# EAGLE design ChargerShieldwFront (EAGLE 6.5.0)
Dings

## Sheet 1 of 2: User Interface
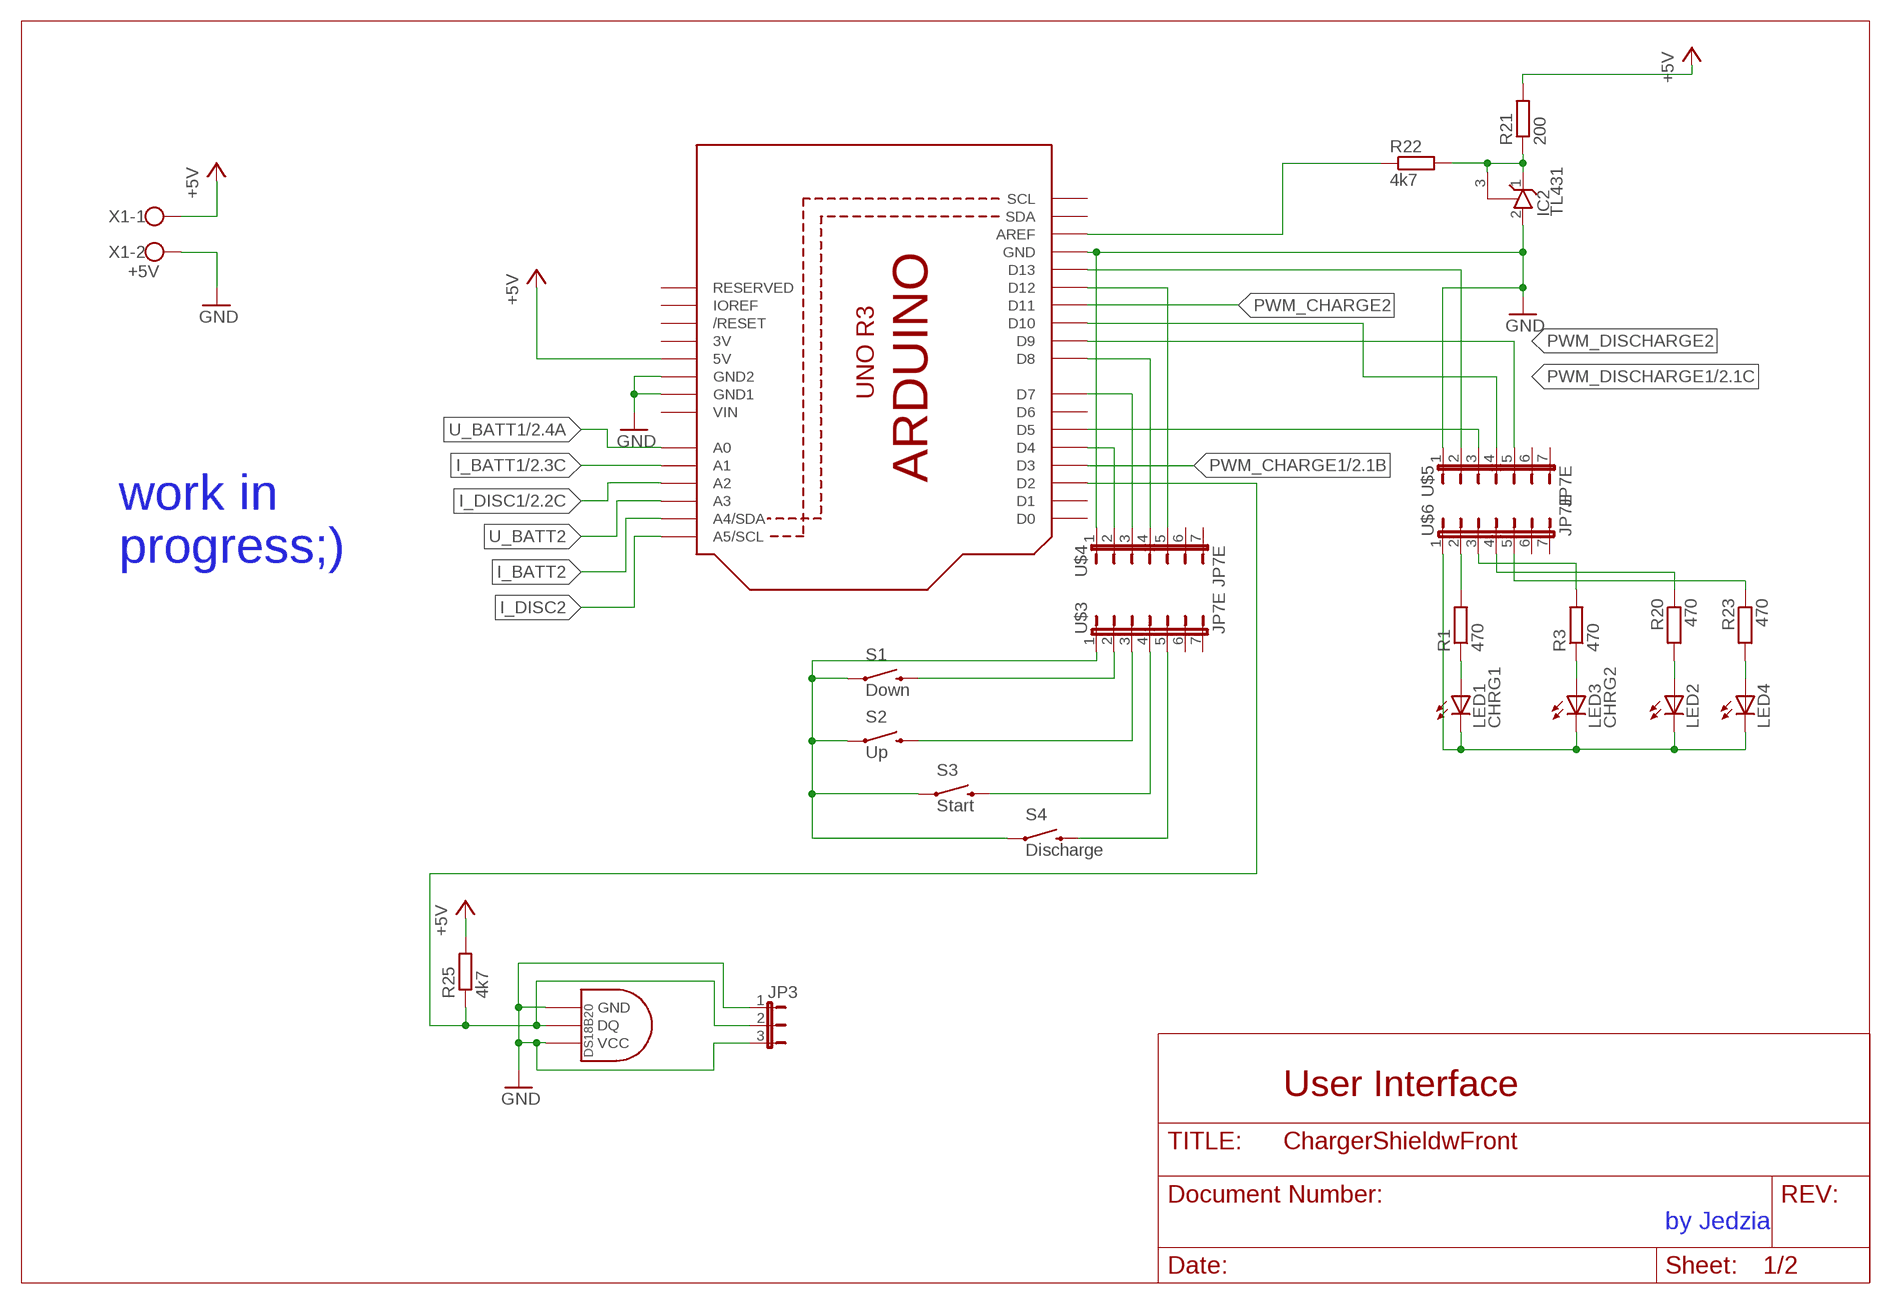
[diagram p0: schematic, sheet 1]

### Parts
IC2  TL431  TL431TO92  [TO92]
JP3  JP2E  [JP2]
LED1  CHRG1  LED5MM_BIG  [LED5MM_BIG]
LED2  LED5MM_BIG  [LED5MM_BIG]
LED3  CHRG2  LED5MM_BIG  [LED5MM_BIG]
LED4  LED5MM_BIG  [LED5MM_BIG]
R1  470  R-EU_0207/12  [0207/12]
R3  470  R-EU_0207/10  [0207/10]
R20  470  R-EU_0207/10  [0207/10]
R21  200  R-EU_0204/7  [0204/7]
R22  4k7  R-EU_0207/10  [0207/10]
R23  470  R-EU_0207/10  [0207/10]
R25  4k7  R-EU_0204/7  [0204/7]
S1  Down  SWITCH-MOMENTARY-2PTH  [TACTILE-PTH]
S2  Up  SWITCH-MOMENTARY-2PTH  [TACTILE-PTH]
S3  Start  SWITCH-MOMENTARY-2PTH  [TACTILE-PTH]
S4  Discharge  SWITCH-MOMENTARY-2PTH  [TACTILE-PTH]
U$1  ARDUINOR3BPLACE-LONG  [ARDUINOR3-BPLACE-LONG]
U$2  DS1820TO92  [DS1820]
U$3  JP7E  [JP7]
U$4  JP7E  [JP7]
U$5  JP7E  [JP7]
U$6  JP7E  [JP7]
X1  +5V  W237-102  [W237-102]

### Nets
+5V: R21.2 R25.2 U$1.5V X1.1 ; also sheet 2
GND: IC2.2(A) JP3.1 JP3.3 U$1.GND U$1.GND1 U$1.GND2 U$2.GND U$2.VDD(VCC) U$4.1 U$5.1 X1.2 ; also sheet 2
GND2: LED1.K(C) LED2.K(C) LED3.K(C) LED4.K(C) S1.1 S2.1 S3.1 S4.1 U$3.1 U$6.1
I_BATT1: U$1.A1 ; also sheet 2
I_BATT2: U$1.A4(A4/SDA)
I_DISC1: U$1.A2 ; also sheet 2
I_DISC2: U$1.A5(A5/SCL)
N$1: U$1.D13 U$5.2
N$2: LED1.A R1.1
N$3: S1.3 U$3.2
N$4: S2.3 U$3.3
N$12: JP3.2 R25.1 U$1.D2 U$2.DQ
N$19: U$1.D5 U$5.3
N$20: LED2.A R20.2
N$21: LED4.A R23.2
N$22: S3.3 U$3.4
N$23: U$1.D12 U$4.5
N$24: LED3.A R3.1
N$26: U$1.D4 U$4.2
N$27: IC2.1(C) IC2.3(R) R21.1 R22.2
N$28: R22.1 U$1.AREF
N$30: U$1.D7 U$4.3
N$31: U$1.D8 U$4.4
N$32: S4.3 U$3.5
N$33: R3.2 U$6.3
N$34: R1.2 U$6.2
N$35: R20.1 U$6.4
N$36: R23.1 U$6.5
PWM_CHARGE1: U$1.D3 ; also sheet 2
PWM_CHARGE2: U$1.D11
PWM_DISCHARGE1: U$1.D10 U$5.4 ; also sheet 2
PWM_DISCHARGE2: U$1.D9 U$5.5
U_BATT1: U$1.A0 ; also sheet 2
U_BATT2: U$1.A3
Unconnected: U$1.D0 U$1.D1 U$1.D6 U$1.IOREF U$1.RESERVED U$1.RESET(/RESET) U$1.SCL U$1.SDA U$3.6 U$3.7 U$4.6 U$4.7 U$5.6 U$5.7 U$6.6 U$6.7

### Notes on the sheet
- work in
  progress;)
- User Interface
- by Jedzia

## Sheet 2 of 2
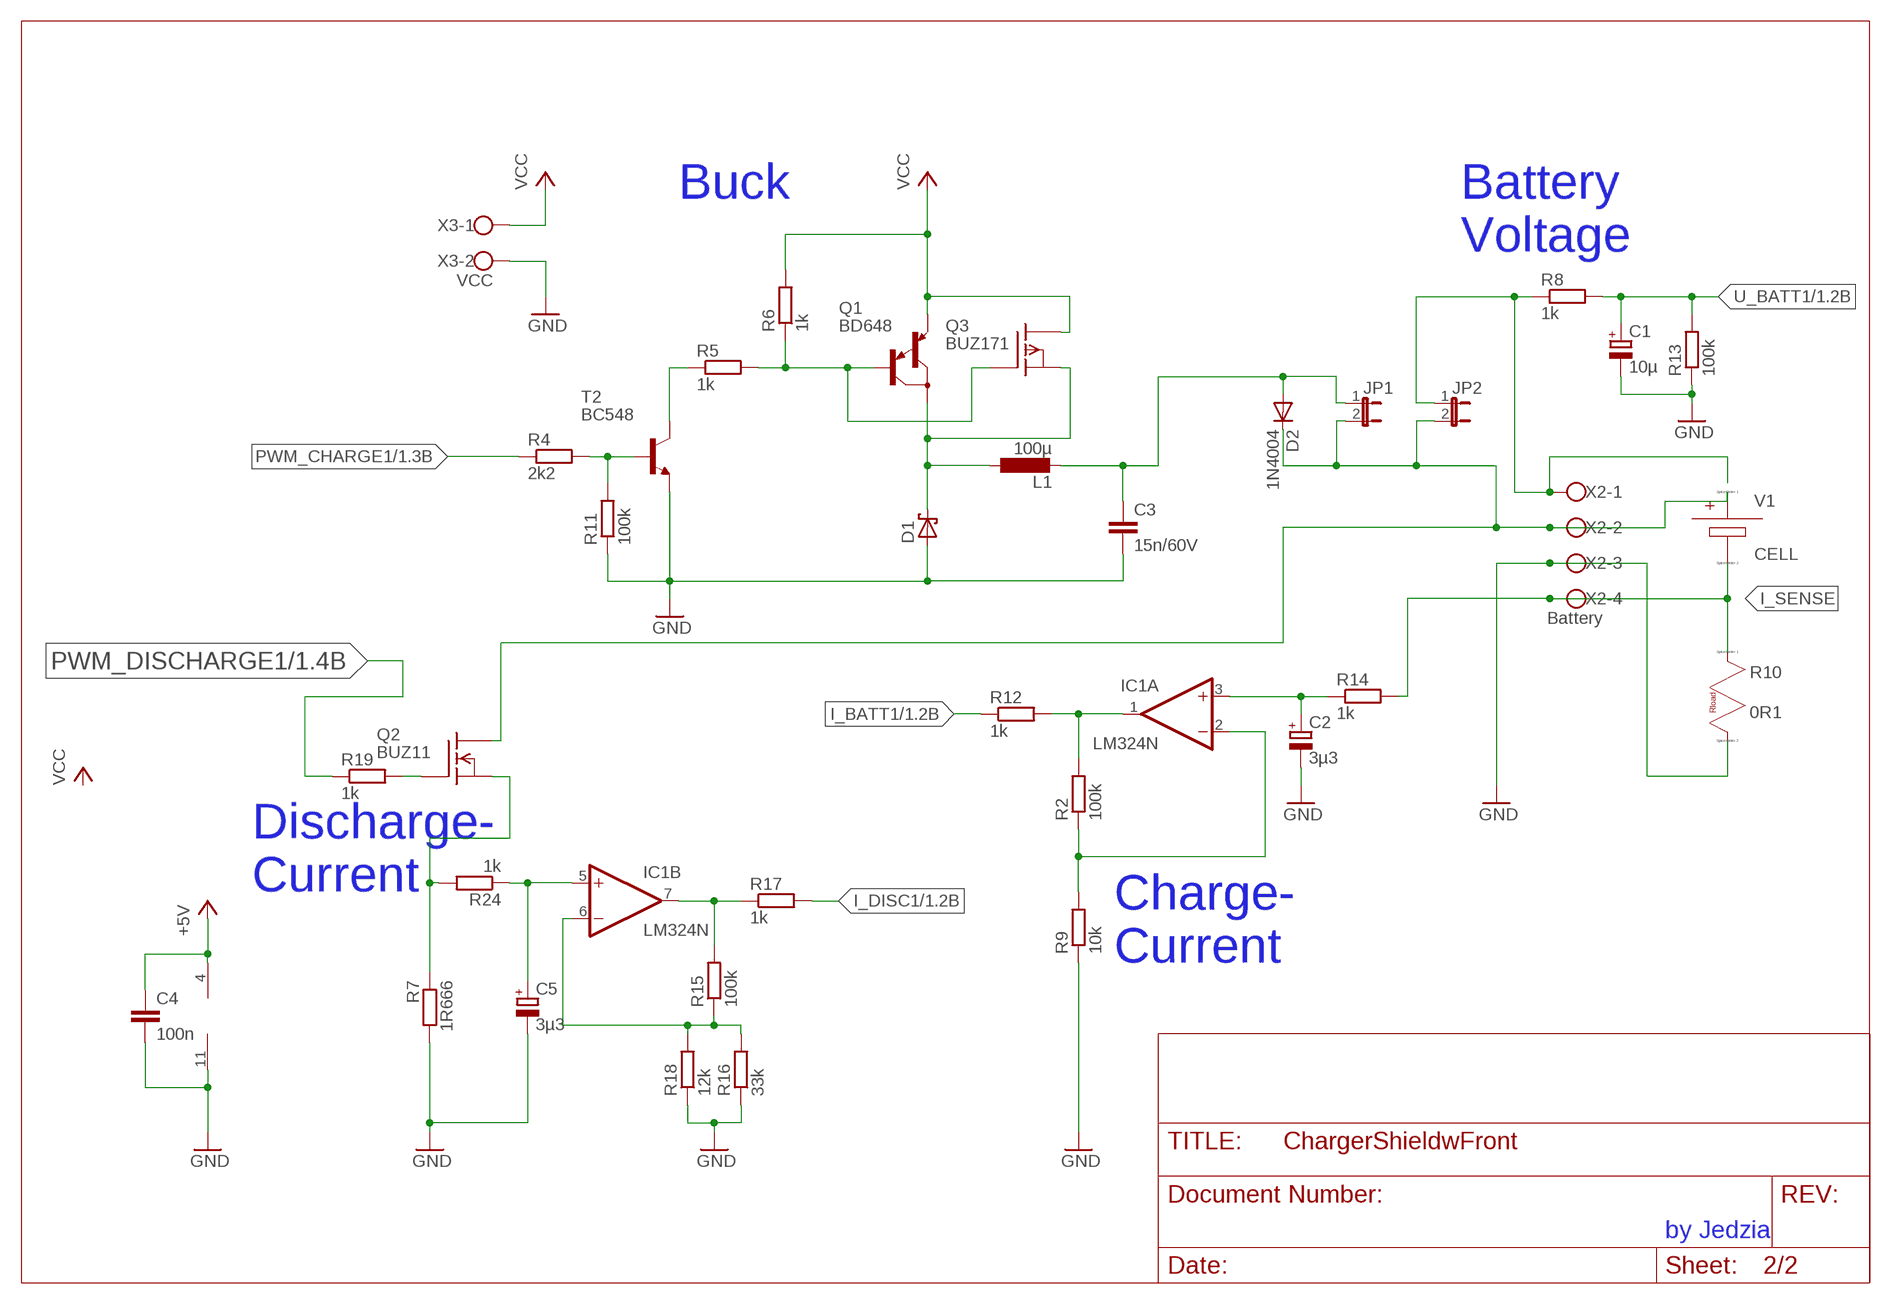
[diagram p1: schematic, sheet 2]

### Parts
C1  10µ  CPOL-EUE5-5  [E5-5]
C2  3µ3  CPOL-EUE5-5  [E5-5]
C3  15n/60V  C-EU025_050-025X075  [C025_050-025X075]
C4  100n  C-EU025_050-025X075  [C025_050-025X075]
C5  3µ3  CPOL-EUE5-5  [E5-5]
D1  SCHOTTKY-DIODEDO35-7  [DO35-7]
D2  1N4004  [DO41-10]
IC1  LM324N  [DIL14]
JP1  JP1E  [JP1]
JP2  JP1E  [JP1]
L1  100µ  L-EU0207/12  [0207/12]
Q1  BD648  [TO220]
Q2  BUZ11  [TO220]
Q3  BUZ171  [TO220]
R2  100k  R-EU_0204/7  [0204/7]
R4  2k2  R-EU_0207/10  [0207/10]
R5  1k  R-EU_0207/10  [0207/10]
R6  1k  R-EU_0207/10  [0207/10]
R7  1R666  R-EU_0414/15  [0414/15]
R8  1k  R-EU_0207/10  [0207/10]
R9  10k  R-EU_0204/7  [0204/7]
R10  0R1  RES_RLOAD  (no package)
R11  100k  R-EU_0207/10  [0207/10]
R12  1k  R-EU_0207/12  [0207/12]
R13  100k  R-EU_0207/10  [0207/10]
R14  1k  R-EU_0207/10  [0207/10]
R15  100k  R-EU_0207/10  [0207/10]
R16  33k  R-EU_0207/10  [0207/10]
R17  1k  R-EU_0207/15  [0207/15]
R18  12k  R-EU_0207/10  [0207/10]
R19  1k  R-EU_0207/12  [0207/12]
R24  1k  R-EU_0207/10  [0207/10]
T2  BC548  BC238  [TO92]
V1  CELL  (no package)
X2  Battery  W237-4  [W237-4]
X3  VCC  W237-102  [W237-102]

### Nets
+5V: C4.1 IC1.4(P:V+) ; also sheet 1
GND: C1.- C2.- C3.2 C4.2 C5.- D1.A IC1.11(P:V-) R7.2 R9.1 R10.B R11.1 R13.1 R16.1 R18.1 T2.1(E) X2.3 X3.2 ; also sheet 1
I_BATT1: R12.1 ; also sheet 1
I_DISC1: R17.2 ; also sheet 1
I_SENSE: R10.A R14.2 V1.- X2.4
N$5: R4.2 R11.2 T2.2(B)
N$6: R5.1 T2.3(C)
N$7: Q1.1(B) Q3.1(G) R5.2 R6.1
N$8: JP2.1 R8.1 X2.1
N$9: D1.C L1.1 Q1.2(C) Q3.3(S)
N$10: C3.1 D2.A JP1.1 L1.2
N$11: IC1.1(A:OUT) R2.2 R12.2
N$13: D2.C JP1.2 JP2.2 Q2.2(D) V1.+ X2.2
N$14: IC1.2(A:-IN) R2.1 R9.2
N$15: C2.+ IC1.3(A:+IN) R14.1
N$16: IC1.6(B:-IN) R15.1 R16.2 R18.2
N$17: IC1.7(B:OUT) R15.2 R17.1
N$18: Q2.1(G) R19.2
N$25: Q2.3(S) R7.1 R24.2
N$29: C5.+ IC1.5(B:+IN) R24.1
PWM_CHARGE1: R4.1 ; also sheet 1
PWM_DISCHARGE1: R19.1 ; also sheet 1
U_BATT1: C1.+ R8.2 R13.2 ; also sheet 1
VCC: Q1.3(E) Q3.2(D) R6.2 X3.1
Unconnected: IC1.8(C:OUT) IC1.9(C:-IN) IC1.10(C:+IN) IC1.12(D:+IN) IC1.13(D:-IN) IC1.14(D:OUT)

### Notes on the sheet
- Buck
- Battery
  Voltage
- Discharge-
  Current
- Charge-
  Current
- by Jedzia

## Power pins joined to a net without a drawn wire
3V: U$1.3V
VIN: U$1.VIN

## Library data of the parts
C1 C2 C5 = rcl:CPOL-EU: POLARIZED CAPACITOR, European symbol
C3 C4 = rcl:C-EU: CAPACITOR, European symbol
D1 = diode:SCHOTTKY-DIODE: Schottky Diode
D2 = diode:1N4004: DIODE general purpose rectifier, 1 A
IC1 = linear:LM324: OP AMP
IC2 = AWJLEagleLib:TL431: TL431 shunt regulator CARE: not a standard pinout. This part has 1: cathode, 2: REF, 3: anode
JP1 JP2 = bigger:JP1E: JUMPER
JP3 = bigger:JP2E: JUMPER
L1 = rcl:L-EU: INDUCTOR, European symbol
LED1-LED4 = bigger:LED: LED OSRAM: - CHIPLED LG R971, LG N971, LY N971, LG Q971, LY Q971, LO R971, LY R971 LH N974, LH R974 LS Q976, LO Q976, LY Q976 LO Q996 - Hyper CHIPLED LW Q18S LB Q993, LB Q99A, LB R99A - SideLED LS A670, LO A670, LY A670, LG A670, LP A670 LB A673, LV A673, LT A673, LW A673 LH A674 LY A675 LS A676, LA A676, LO A676, LY A676, LW A676 LS A679, LY A679, LG A679 - Hyper Micro SIDELED® LS Y876, LA Y876, LO Y876, LY Y876 LT Y87S - SmartLED LW L88C, LW L88S LB L89C, LB L89S, LG L890 LS L89K, LO L89K, LY L89K LS L896, LA L896, LO L896, LY L896 - TOPLED LS T670, LO T670, LY T670, LG T670, LP T670 LSG T670, LSP T670, LSY T670, LOP T670, LYG T670 LG T671, LOG T671, LSG T671 LB T673, LV T673, LT T673, LW T673 LH T674 LS T676, LA T676, LO T676, LY T676, LB T676, LH T676, LSB T676, LW T676 LB T67C, LV T67C, LT T67C, LS T67K, LO T67K, LY T67K, LW E67C LS E67B, LA E67B, LO E67B, LY E67B, LB E67C, LV E67C, LT E67C LW T67C LS T679, LY T679, LG T679 LS T770, LO T770, LY T770, LG T770, LP T770 LB T773, LV T773, LT T773, LW T773 LH T774 LS E675, LA E675, LY E675, LS T675 LS T776, LA T776, LO T776, LY T776, LB T776 LHGB T686 LT T68C, LB T68C - Hyper Mini TOPLED® LB M676 - Mini TOPLED Santana® LG M470 LS M47K, LO M47K, LY M47K Source: http://www.osram.convergy.de LUXEON: - LUMILED® LXK2-PW12-R00, LXK2-PW12-S00, LXK2-PW14-U00, LXK2-PW14-V00 LXK2-PM12-R00, LXK2-PM12-S00, LXK2-PM14-U00 LXK2-PE12-Q00, LXK2-PE12-R00, LXK2-PE12-S00, LXK2-PE14-T00, LXK2-PE14-U00 LXK2-PB12-K00, LXK2-PB12-L00, LXK2-PB12-M00, LXK2-PB14-N00, LXK2-PB14-P00, LXK2-PB14-Q00 LXK2-PR12-L00, LXK2-PR12-M00, LXK2-PR14-Q00, LXK2-PR14-R00 LXK2-PD12-Q00, LXK2-PD12-R00, LXK2-PD12-S00 LXK2-PH12-R00, LXK2-PH12-S00 LXK2-PL12-P00, LXK2-PL12-Q00, LXK2-PL12-R00 Source: www.luxeon.com KINGBRIGHT: KA-3528ASYC Source: www.kingbright.com
Q1 = transistor-pnp:BD648: PNP Darlington Transistor
Q2 = transistor-fet:BUZ11: N-Channel Enhancement MOSFET 50V; 30A; 0,040Ohm
Q3 = transistor-fet:BUZ171: P-Channel Enhancement MOSFET -50V; 7A; 0,4Ohm
R1-R9 R11-R25 = rcl:R-EU_: RESISTOR, European symbol
R10 = lt-spice-simulation:RES_RLOAD: A resistor
S1-S4 = SparkFun-Electromechanical:SWITCH-MOMENTARY-2: Various NO switches- pushbuttons, reed, etc
T2 = transistor:BC238: NPN TRANSISTOR
U$1 = arduino-long:ARDUINOR3: This is a new object for the new Arduino R3 - with extra pins that you may want to use (such as IOref, and duplicated A4/A5
U$2 = Ava:DS1820: DS18B20 Programmable Resolution 1-Wire Digital Thermometer Description The DS18B20 digital thermometer provides 9-bit to 12-bit Celsius temperature measurements and has an alarm function with nonvolatile user-programmable upper and lower trigger points. The DS18B20 communicates over a 1-Wire® bus that by definition requires only one data line (and ground) for communication with a central microprocessor. It has an operating temperature range of -55°C to +125°C and is accurate to ±0.5°C over the range of -10°C to +85°C. In addition, the DS18B20 can derive power directly from the data line ("parasite power"), eliminating the need for an external power supply. Each DS18B20 has a unique 64-bit serial code, which allows multiple DS18B20s to function on the same 1-Wire bus. Thus, it is simple to use one microprocessor to control many DS18B20s distributed over a large area. Applications that can benefit from this feature include HVAC environmental controls, temperature monitoring systems inside buildings, equipment, or machinery, and process monitoring and control systems.
U$3-U$6 = bigger:JP7E
V1 = Misc:CELL: Voltage Source, either DC, AC, PULSE, SINE, PWL, EXP, or SFFM
X1 X3 = con-wago-500:W237-102: WAGO SCREW CLAMP; MPN: 237-102; OC_FARNELL: unknown; OC_NEWARK: 70K9898
X2 = con-wago-500:W237-4: WAGO SCREW CLAMP; OC_FARNELL: unknown; OC_NEWARK: unknown

## Board
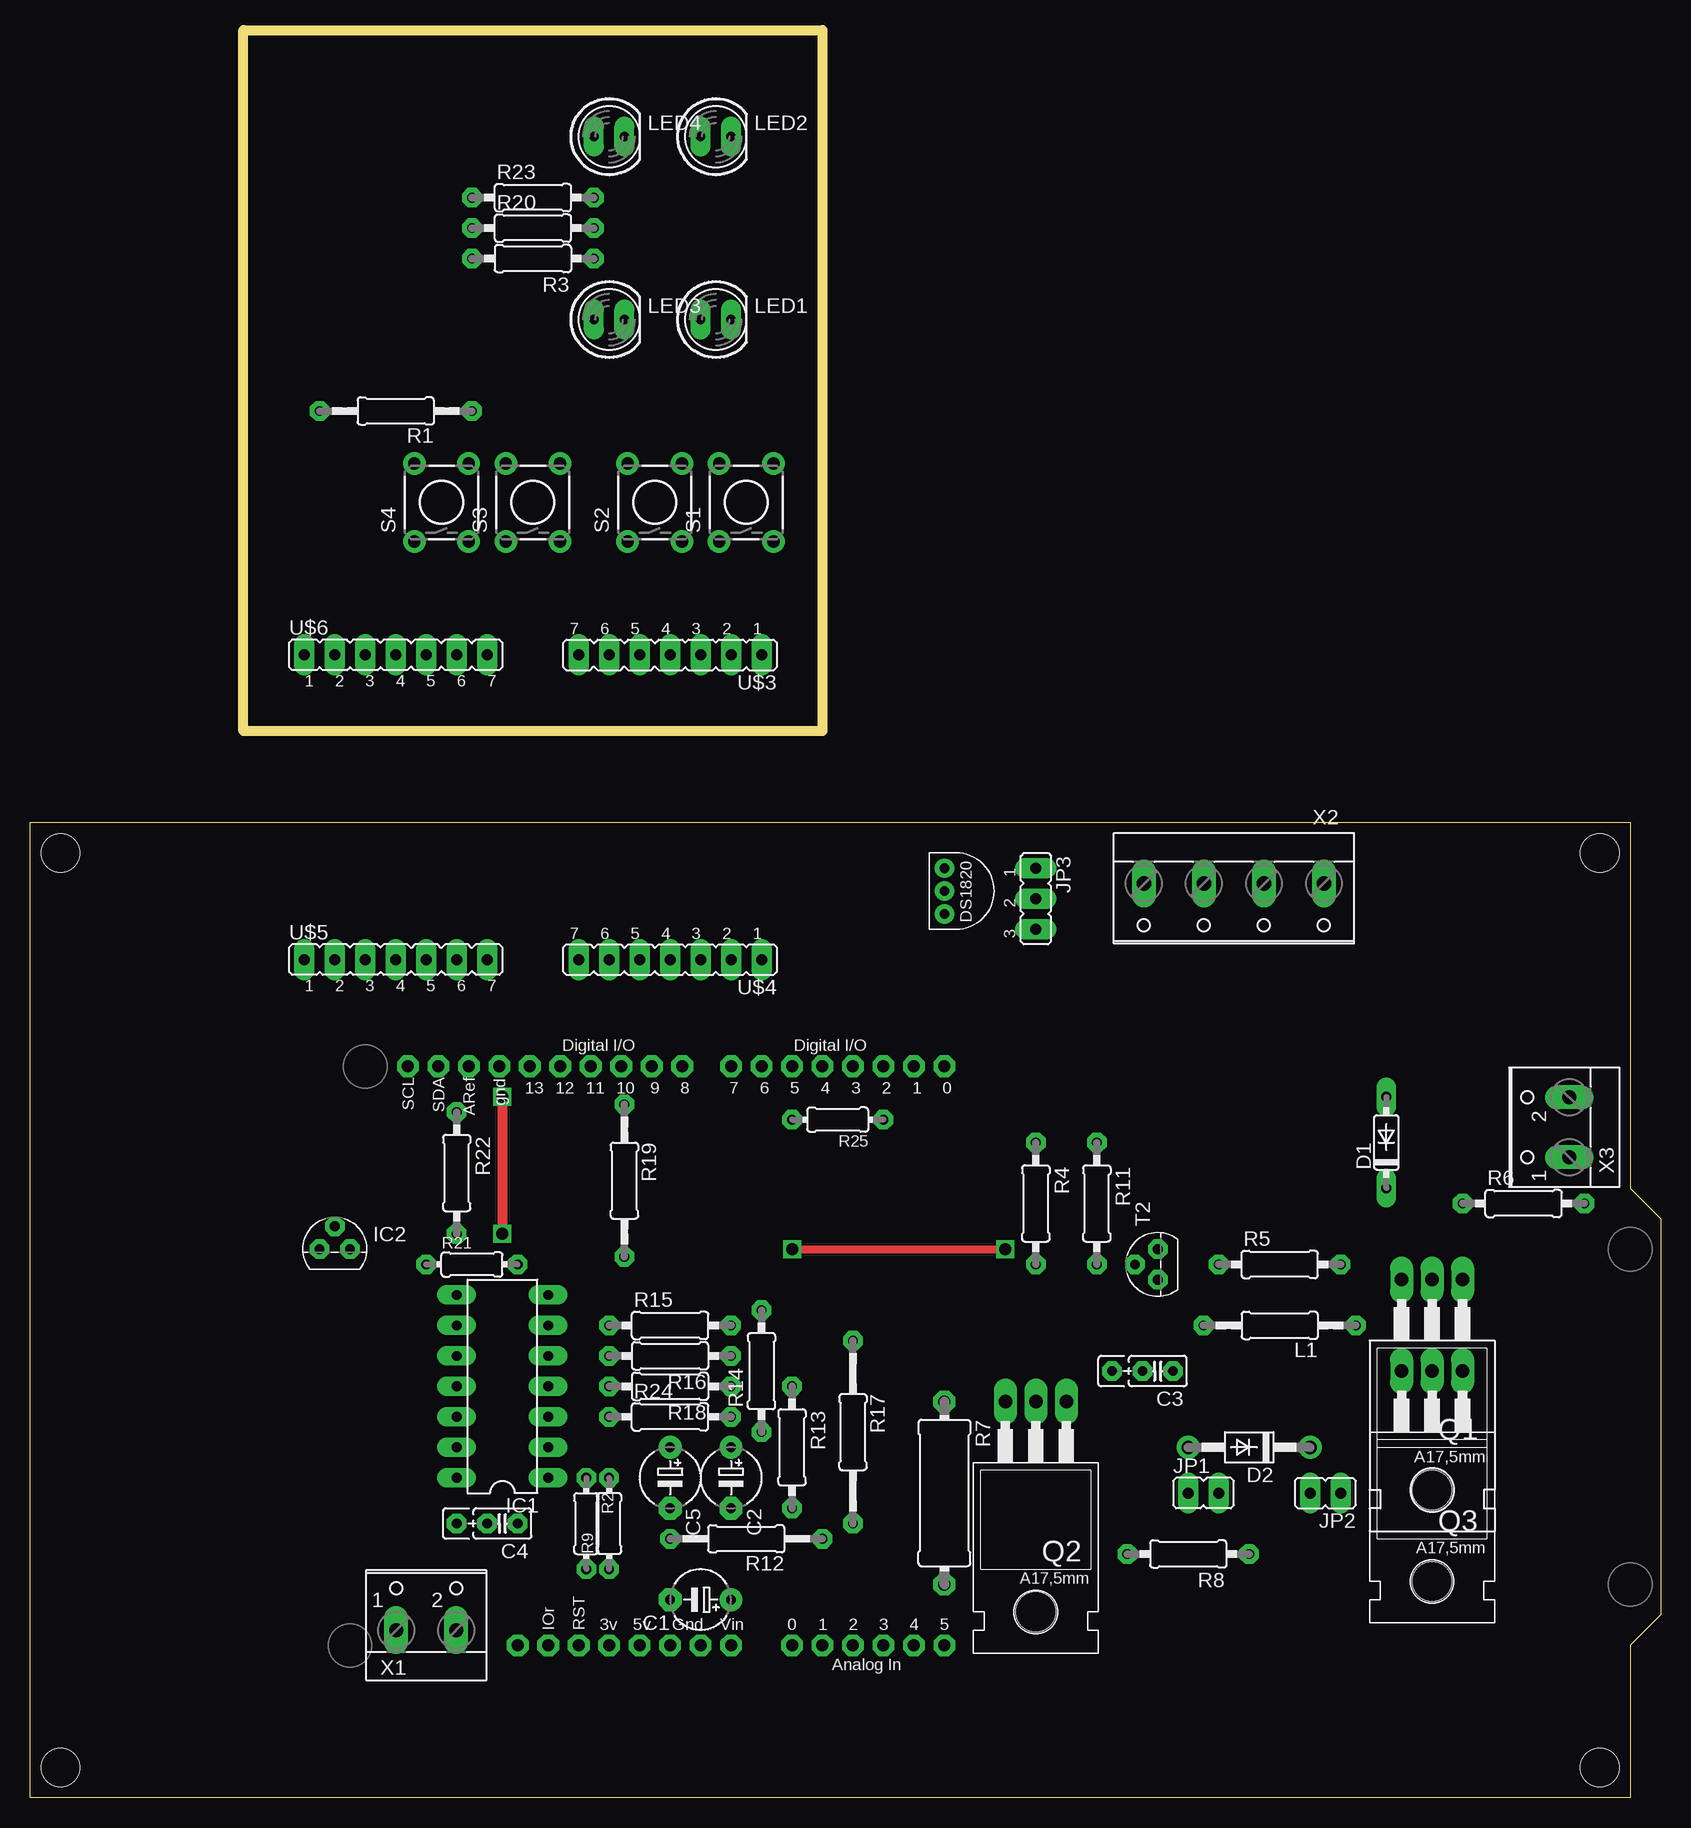
[diagram p2: board, top side]
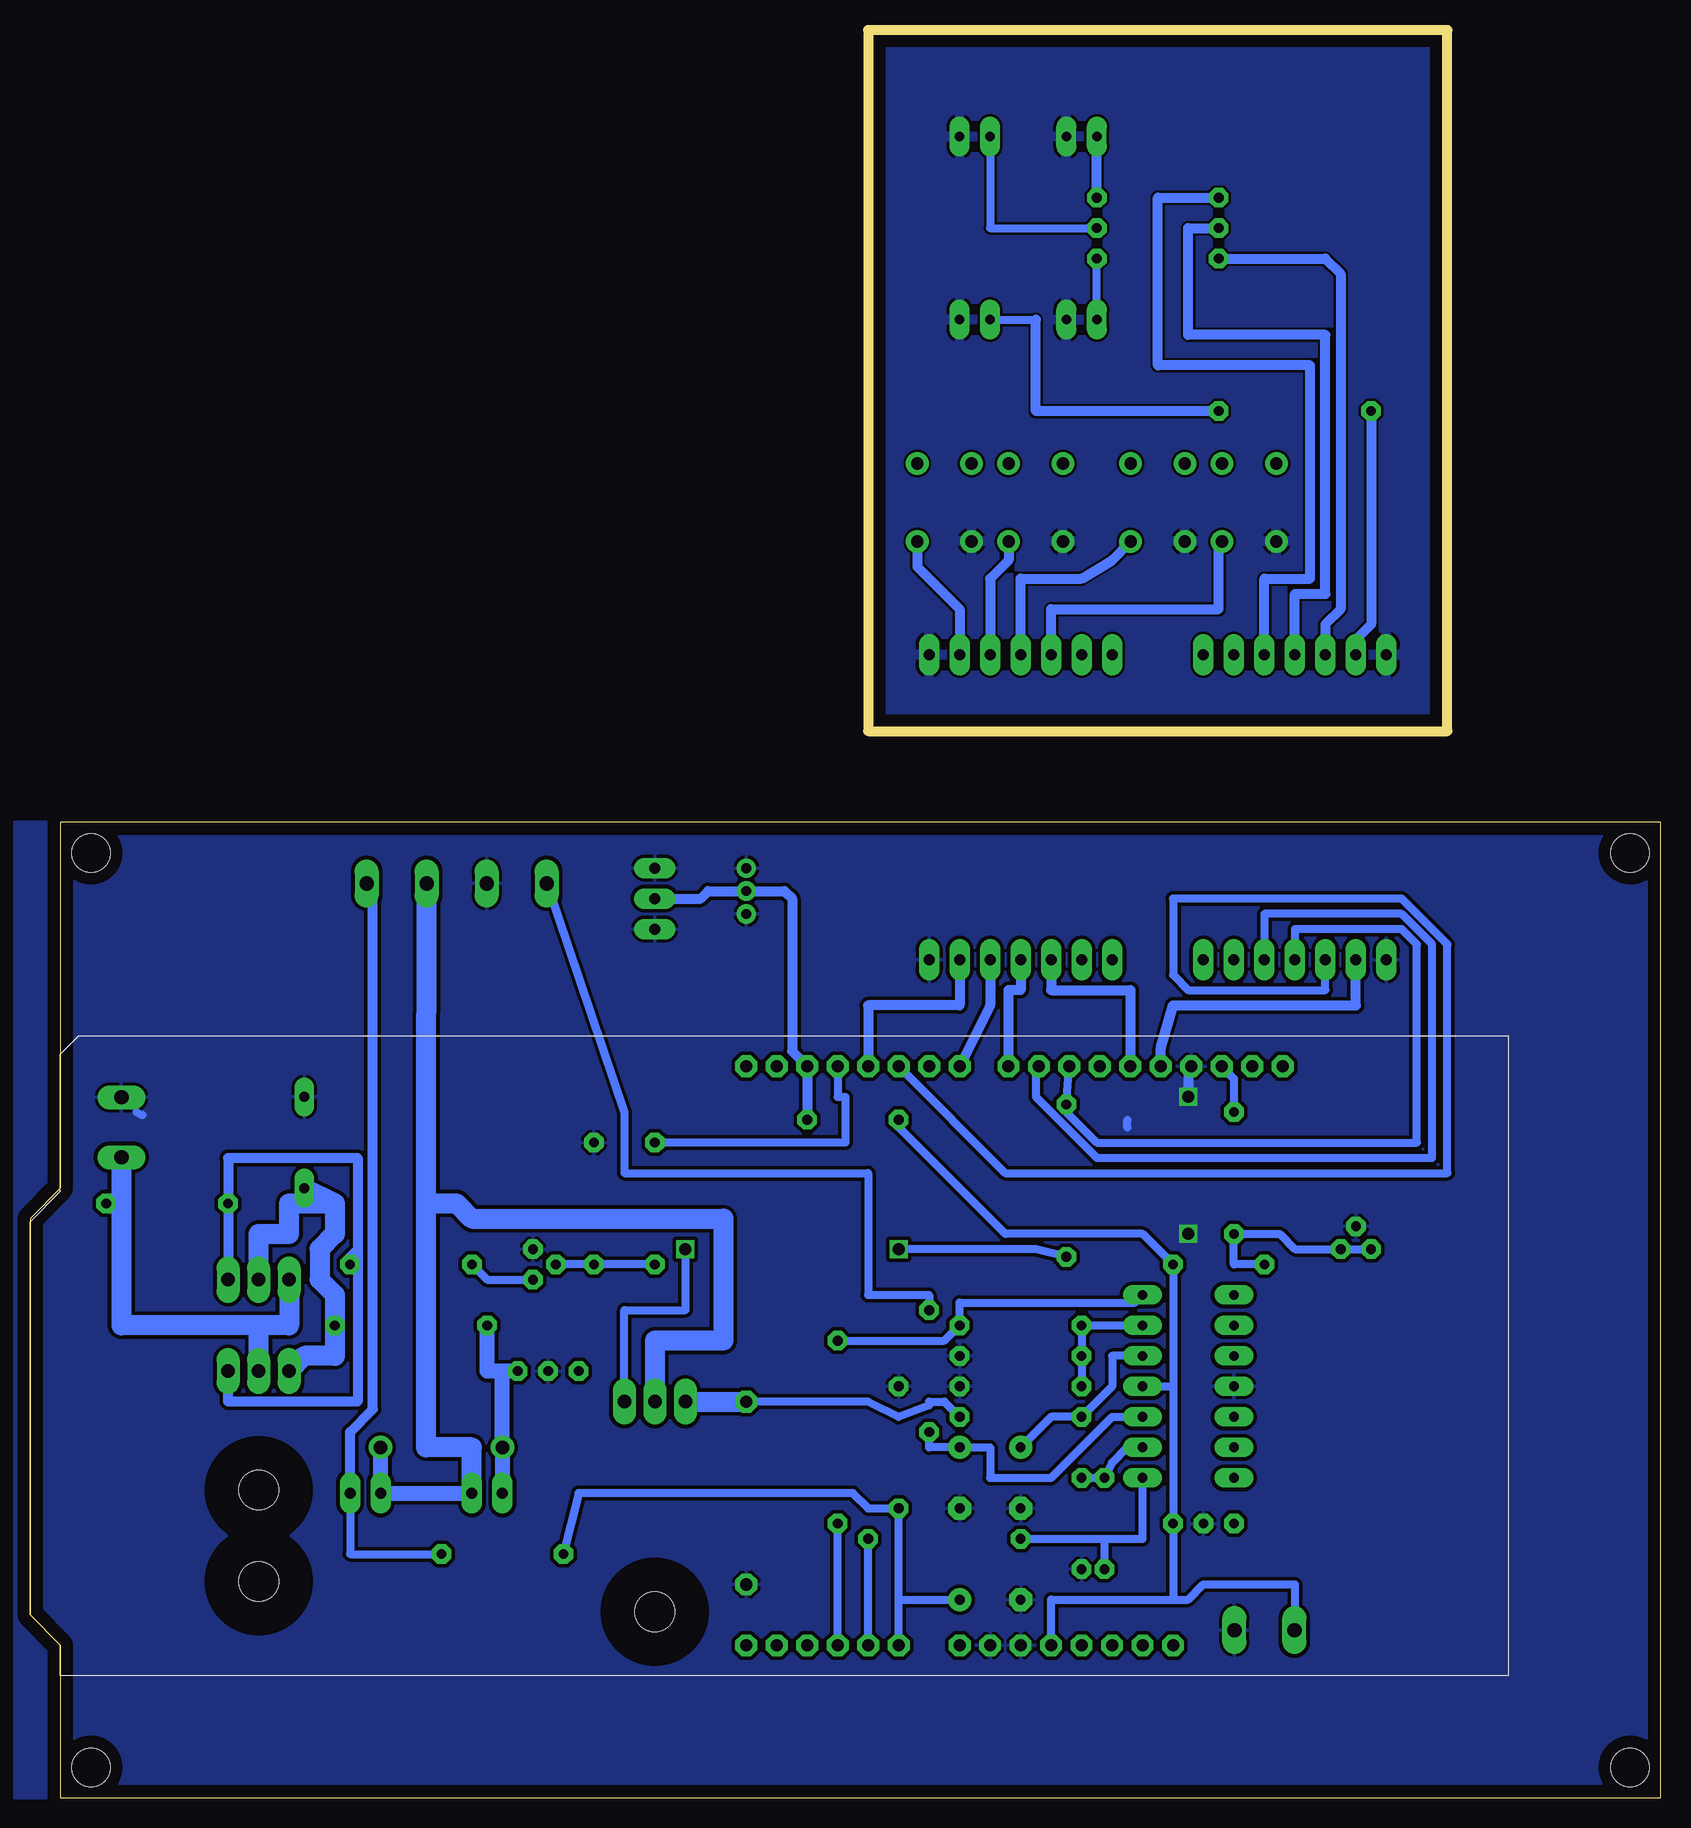
[diagram p3: board, bottom side, seen from below]

Size 135.89 x 147.32 mm. Coordinates in mm from the lower left corner, seen from the top.
Outline: 0,81.28 133.35,81.28 133.35,50.8 135.89,48.26 135.89,15.24 133.35,12.7 133.35,0 0,0 0,81.28
Outline: 66.04,88.9 17.78,88.9 17.78,147.32 66.04,147.32 66.04,88.9
Copper layers (1*16): Top 0.035mm / dielectric 1.5mm / Bottom 0.035mm
Design rules "serialTTl *": minimum track width 26mil, minimum drill 24mil, track to track 8mil, track to pad 8mil, pad to pad 8mil, via to via 8mil, smd to smd 8mil, copper to edge 40mil, drill to drill 8mil, minimum pad ring 16mil, minimum via ring 8mil, stop-mask expansion 4mil, vias tented up to drill 0mil, thermal gap 10mil
Holes 3.2 mm at 2.54,2.54 2.54,78.74 130.81,2.54 130.81,78.74

### Footprints (pad centres in the part's own frame; a part is rotated, then mirrored left to right if it is on the bottom)
E5-5 = drill 0.813 pad 1.905: + -2.54,0 | drill 0.813 pad 1.905 octagon: - 2.54,0
C025_050-025X075 = drill 0.813 octagon: 1 -1.27,0; 2 1.27,0; 3 3.81,0
DO35-7 = drill 0.813 long: A 3.81,0; C -3.81,0
DO41-10 = drill 1.118: A 5.08,0; C -5.08,0
DIL14 = drill 0.813 long: 1 -7.62,-3.81; 2 -5.08,-3.81; 3 -2.54,-3.81; 4 0,-3.81; 5 2.54,-3.81; 6 5.08,-3.81; 7 7.62,-3.81; 8 7.62,3.81; 9 5.08,3.81; 10 2.54,3.81; 11 0,3.81; 12 -2.54,3.81; 13 -5.08,3.81; 14 -7.62,3.81
TO92 = drill 0.813 octagon: 1 1.27,-1.27; 2 0,0.635; 3 -1.27,-1.27
JP1 = drill 0.914 long: 1 0,-1.27; 2 0,1.27
JP2 = drill 0.914 long: 1 -2.54,0; 2 0,0; 3 2.54,0
0207/12 = drill 0.813 octagon: 1 -6.35,0; 2 6.35,0
LED5MM_BIG = drill 0.8 pad 1.676 long: A -1.27,0; K 1.27,0
TO220 = drill 1.118 long: 1 -2.54,-6.35; 2 0,-6.35; 3 2.54,-6.35 | hole 3.302: 0,11.176
0204/7 = drill 0.813 octagon: 1 -3.81,0; 2 3.81,0
0207/10 = drill 0.813 octagon: 1 -5.08,0; 2 5.08,0
0414/15 = drill 1.016 octagon: 1 -7.62,0; 2 7.62,0
0207/15 = drill 0.813 octagon: 1 -7.62,0; 2 7.62,0
TACTILE-PTH = drill 1.016 pad 1.88: 1 -3.251,2.261; 2 3.251,2.261; 3 -3.251,-2.261; 4 3.251,-2.261
TO92' = drill 0.813 octagon: 1 1.27,0; 2 0,1.905; 3 -1.27,0
ARDUINOR3-BPLACE-LONG = drill 1 pad 1.676 octagon: 3V 35.56,2.54; 5V 38.1,2.54; A0 50.8,2.54; A1 53.34,2.54; A2 55.88,2.54; A3 58.42,2.54; A4 60.96,2.54; A5 63.5,2.54; AREF 23.876,50.8; D0 63.5,50.8; D1 60.96,50.8; D2 58.42,50.8; D3 55.88,50.8; D4 53.34,50.8; D5 50.8,50.8; D6 48.26,50.8; D7 45.72,50.8; D8 41.656,50.8; D9 39.116,50.8; D10 36.576,50.8; D11 34.036,50.8; D12 31.496,50.8; D13 28.956,50.8; GND 26.416,50.8; GND1 43.18,2.54; GND2 40.64,2.54; IOREF 30.48,2.54; RESERVED 27.94,2.54; RESET 33.02,2.54; SCL 18.796,50.8; SDA 21.336,50.8; VIN 45.72,2.54
DS1820 = drill 0.8: DQ 2.54,-1.27; GND 0.635,-1.27; VDD 4.445,-1.27
JP7 = drill 0.914 long: 1 -7.62,0; 2 -5.08,0; 3 -2.54,0; 4 0,0; 5 2.54,0; 6 5.08,0; 7 7.62,0
W237-102 = drill 1.194 long: 1 -2.5,-1.27; 2 2.5,-1.27
W237-4 = drill 1.194 long: 1 -7.5,-1.27; 2 -2.5,-1.27; 3 2.5,-1.27; 4 7.5,-1.27

### Placement (x,y rotation side)
C1  55.88,16.51 180 top
C2  58.42,26.67 270 top
C3  93.98,35.56 180 top
C4  39.37,22.86 180 top
C5  53.34,26.67 270 top
D1  113.03,54.61 90 top
D2  101.6,29.21 180 top
IC1  39.37,34.29 90 top
IC2  25.4,46.99 0 top
JP1  97.79,25.4 270 top
JP2  107.95,25.4 90 top
JP3  83.82,74.93 270 top
L1  104.14,39.37 180 top
LED1  57.15,123.19 0 top
LED2  57.15,138.43 0 top
LED3  48.26,123.19 0 top
LED4  48.26,138.43 0 top
Q1  116.84,36.83 180 top
Q2  83.82,26.67 180 top
Q3  116.84,29.21 180 top
R1  30.48,115.57 180 top
R2  46.36,22.86 270 top
R3  41.91,128.27 180 top
R4  83.82,49.53 270 top
R5  104.14,44.45 0 top
R6  124.46,49.53 0 top
R7  76.2,25.4 270 top
R8  96.52,20.32 180 top
R9  48.26,22.86 90 top
R11  88.9,49.53 270 top
R12  59.69,21.59 180 top
R13  63.5,29.21 270 top
R14  60.96,35.56 90 top
R15  53.34,39.37 0 top
R16  53.34,36.83 180 top
R17  68.58,30.48 270 top
R18  53.34,34.29 180 top
R19  49.53,51.44 270 top
R20  41.91,130.81 0 top
R21  36.83,44.45 0 top
R22  35.56,52.07 270 top
R23  41.91,133.35 0 top
R24  53.34,31.75 0 top
R25  67.31,56.52 180 top
S1  59.69,107.95 90 top
S2  52.07,107.95 90 top
S3  41.91,107.95 90 top
S4  34.29,107.95 90 top
T2  BC548  [TO92']  93.98,44.45 90 top
U$1  12.7,10.16 0 top
U$2  77.47,78.1 270 top
U$3  53.34,95.25 180 top
U$4  53.34,69.85 180 top
U$5  30.48,69.85 0 top
U$6  30.48,95.25 0 top
X1  33.02,15.24 0 top
X2  100.33,74.93 180 top
X3  127,55.88 90 top

### Tracks (layer width: path | path; a pad name or v marks a point on that pad's centre or on a via)
+5V
  Bottom 0.66: 40.64,16.51 50.8,16.51 U$1.5V | 40.64,16.51 39.37,16.51 38.1,17.78 30.48,17.78 30.48,13.97 X1.1 | 40.64,34.29 C4.1 40.64,16.51 | IC1.4 40.64,34.29 | 40.64,34.29 R21.2 43.18,46.99 54.61,46.99 63.5,55.88 R25.2
GND  (via drill 1)
  Top 0.813: v39.37,58.42 v39.37,46.99
  Bottom 0.66: 127,57.15 126.53,56.89 | 44.45,55.88 44.45,56.49
  Bottom 0.813: U$1.GND 39.37,60.96 v39.37,58.42
  pour Bottom (isolate 0.305): 0,0 0,81.28 137.16,81.28 137.16,0
GND2
  pour Bottom: 66.04,88.9 66.04,147.32 17.78,147.32 17.78,88.9
I_BATT1
  Bottom 0.66: U$1.A1 R12.1
I_DISC1
  Bottom 0.66: U$1.A2 R17.2
I_SENSE
  Bottom 0.66: R14.2 60.96,41.91 66.04,41.91 66.04,52.07 86.36,52.07 86.36,57.15 X2.4
N$1
  Bottom 0.813: U$1.D13 41.66,62.48 40.64,66.04 25.4,66.04 U$5.2
N$2
  Bottom 0.66: LED1.A 52.07,123.19
  Bottom 0.813: R1.1 52.07,115.57 52.07,123.19
N$3
  Bottom 0.813: S1.3 61.95,102.59 58.42,99.06 U$3.2
N$4
  Bottom 0.813: S2.3 54.33,103.15 55.88,101.6 U$3.3
N$5
  Bottom 0.66: R4.2 R11.2 T2.2
N$6
  Bottom 0.66: R5.1 97.79,43.18 T2.3
N$7
  Bottom 0.813: Q3.1 119.38,33.02 108.59,33.02 108.59,45.72 | 108.59,45.72 108.59,53.34 119.38,53.34 R6.1 Q1.1 | R5.2 109.22,45.08 108.59,45.72
N$8
  Bottom 0.66: JP2.1 109.22,20.32 R8.1 | 107.95,76.2 X2.1
  Bottom 0.813: X2.1 107.31,75.69 107.31,32.39 109.22,30.48 JP2.1
N$9
  Bottom 0.66: Q1.2 116.84,41.91
  Bottom 1.676: 110.49,49.53 114.3,49.53 114.3,46.99 116.84,46.99 Q1.2 | 110.49,49.53 110.49,46.99 111.76,45.72 111.76,43.18 110.49,41.91 L1.1 110.49,36.83 113.03,36.83 Q3.3 | 110.49,49.53 D1.C
N$10
  Bottom 1.27: C3.1 96.52,35.56 | JP1.1 D2.A 96.52,35.56 | 96.52,35.56 97.79,35.56 L1.2
N$11
  Bottom 0.66: 43.81,26.67 IC1.1 43.18,21.59 46.36,21.59 | R12.2 46.36,21.59 | 46.36,21.59 R2.2
N$12
  Bottom 0.813: JP3.2 80.01,74.93 79.38,75.56 U$2.DQ 73.03,75.56 72.39,74.93 72.39,62.23 U$1.D2 R25.1
N$13
  Bottom 1.27: JP1.2 JP2.2 D2.C
  Bottom 1.676: JP1.2 99.06,29.21 102.87,29.21 102.87,49.53 | 102.87,49.53 102.87,54.61 X2.2 | 102.87,49.53 100.33,49.53 99.06,48.26 78.11,48.26 78.11,38.1 83.82,38.1 Q2.2
N$14
  Bottom 0.66: R9.2 R2.1 45.72,27.94 44.45,29.21 IC1.2
N$15
  Bottom 0.66: R14.1 60.96,29.21 C2.+ 55.88,29.21 55.88,26.67 50.8,26.67 45.72,31.75 IC1.3
N$16
  Bottom 0.66: R18.2 R16.2 R15.1 IC1.6
N$17
  Bottom 0.66: R17.1 59.69,38.1 R15.2 58.42,41.27 43.81,41.27 IC1.7
N$18  (via drill 1)
  Top 0.66: v63.5,45.72 v81.28,45.72
  Bottom 0.66: Q2.1 86.36,40.64 81.28,40.64 v81.28,45.72 | R19.2 52.07,45.72 v63.5,45.72
N$19
  Bottom 0.66: U$5.3 27.94,67.31 39.37,67.31 40.64,68.58 40.64,74.93 21.59,74.93 17.78,71.12 17.78,52.07 54.61,52.07 U$1.D5
N$20
  Bottom 0.66: LED2.A 55.88,130.81 R20.2
N$21
  Bottom 0.813: R23.2 LED4.A
N$22
  Bottom 0.813: U$3.4 53.34,101.6 48.26,101.6 45.72,103.15 S3.3
N$23
  Bottom 0.66: 44.45,60.96 U$1.D12
  Bottom 0.813: U$4.5 50.8,67.31 44.2,67.31 U$1.D12
N$24
  Bottom 0.66: LED3.A R3.1
N$25
  Bottom 0.66: R7.1 66.04,33.02 63.5,31.75 60.96,32.7 60.96,33.02 59.69,33.02 R24.2
  Bottom 1.676: Q2.3 R7.1
N$26
  Bottom 0.813: U$4.2 58.42,66.04 66.04,66.04 U$1.D4
N$27
  Bottom 0.66: R21.1 35.56,44.45 R22.2 31.75,46.99 30.48,45.72 IC2.1 IC2.3
N$28
  Bottom 0.66: U$1.AREF 35.56,59.94 R22.1
N$29
  Bottom 0.66: IC1.5 45.72,36.83 45.72,34.29 R24.1 50.8,31.75 C5.+
N$30
  Bottom 0.813: U$4.3 55.88,66.04 U$1.D7
N$31
  Bottom 0.813: U$4.4 53.34,67.31 54.36,67.31 U$1.D8
N$32
  Bottom 0.813: U$3.5 50.8,99.06 36.83,99.06 36.83,104.42 S4.3
N$33
  Bottom 0.813: R3.2 27.94,128.27 26.67,127 26.67,99.06 27.94,97.79 U$6.3
N$34
  Bottom 0.813: R1.2 24.13,97.79 25.4,96.52 U$6.2
N$35
  Bottom 0.813: U$6.4 30.48,100.33 27.94,100.33 27.94,121.92 39.37,121.92 39.37,130.81 R20.1
N$36
  Bottom 0.813: U$6.5 33.02,101.6 29.21,101.6 29.21,119.38 41.91,119.38 41.91,133.35 R23.1
PWM_CHARGE1
  Bottom 0.66: U$1.D3 68.58,58.42 67.94,58.42 67.94,54.61 R4.1
PWM_DISCHARGE1
  Bottom 0.66: U$1.D10 R19.1 49.53,57.15 46.99,54.61 20.32,54.61 20.32,71.12 21.59,72.39 30.48,72.39 U$5.4
PWM_DISCHARGE2
  Bottom 0.66: U$5.5 33.02,73.66 21.59,73.66 19.05,71.12 19.05,53.34 46.99,53.34 52.07,58.42 52.07,60.96
  Bottom 0.813: 52.07,60.96 U$1.D9
U_BATT1
  Bottom 0.66: U$1.A0 63.5,16.51 | 63.5,16.51 R13.2 66.04,24.13 67.31,25.4 90.17,25.4 R8.2 | 63.5,16.51 C1.+
VCC
  Bottom 0.66: 128.27,53.34 X3.1
  Bottom 1.676: 128.27,53.34 128.27,49.53 | 128.27,49.53 128.27,39.37 116.84,39.37 | Q1.3 114.3,39.37 116.84,39.37 | Q3.2 116.84,39.37 | R6.2 128.27,49.53